# EAGLE design Femtoduino (EAGLE 7.7.0)
REVISION: A; VERSION: 1.0
Assembly variants: Test Variant
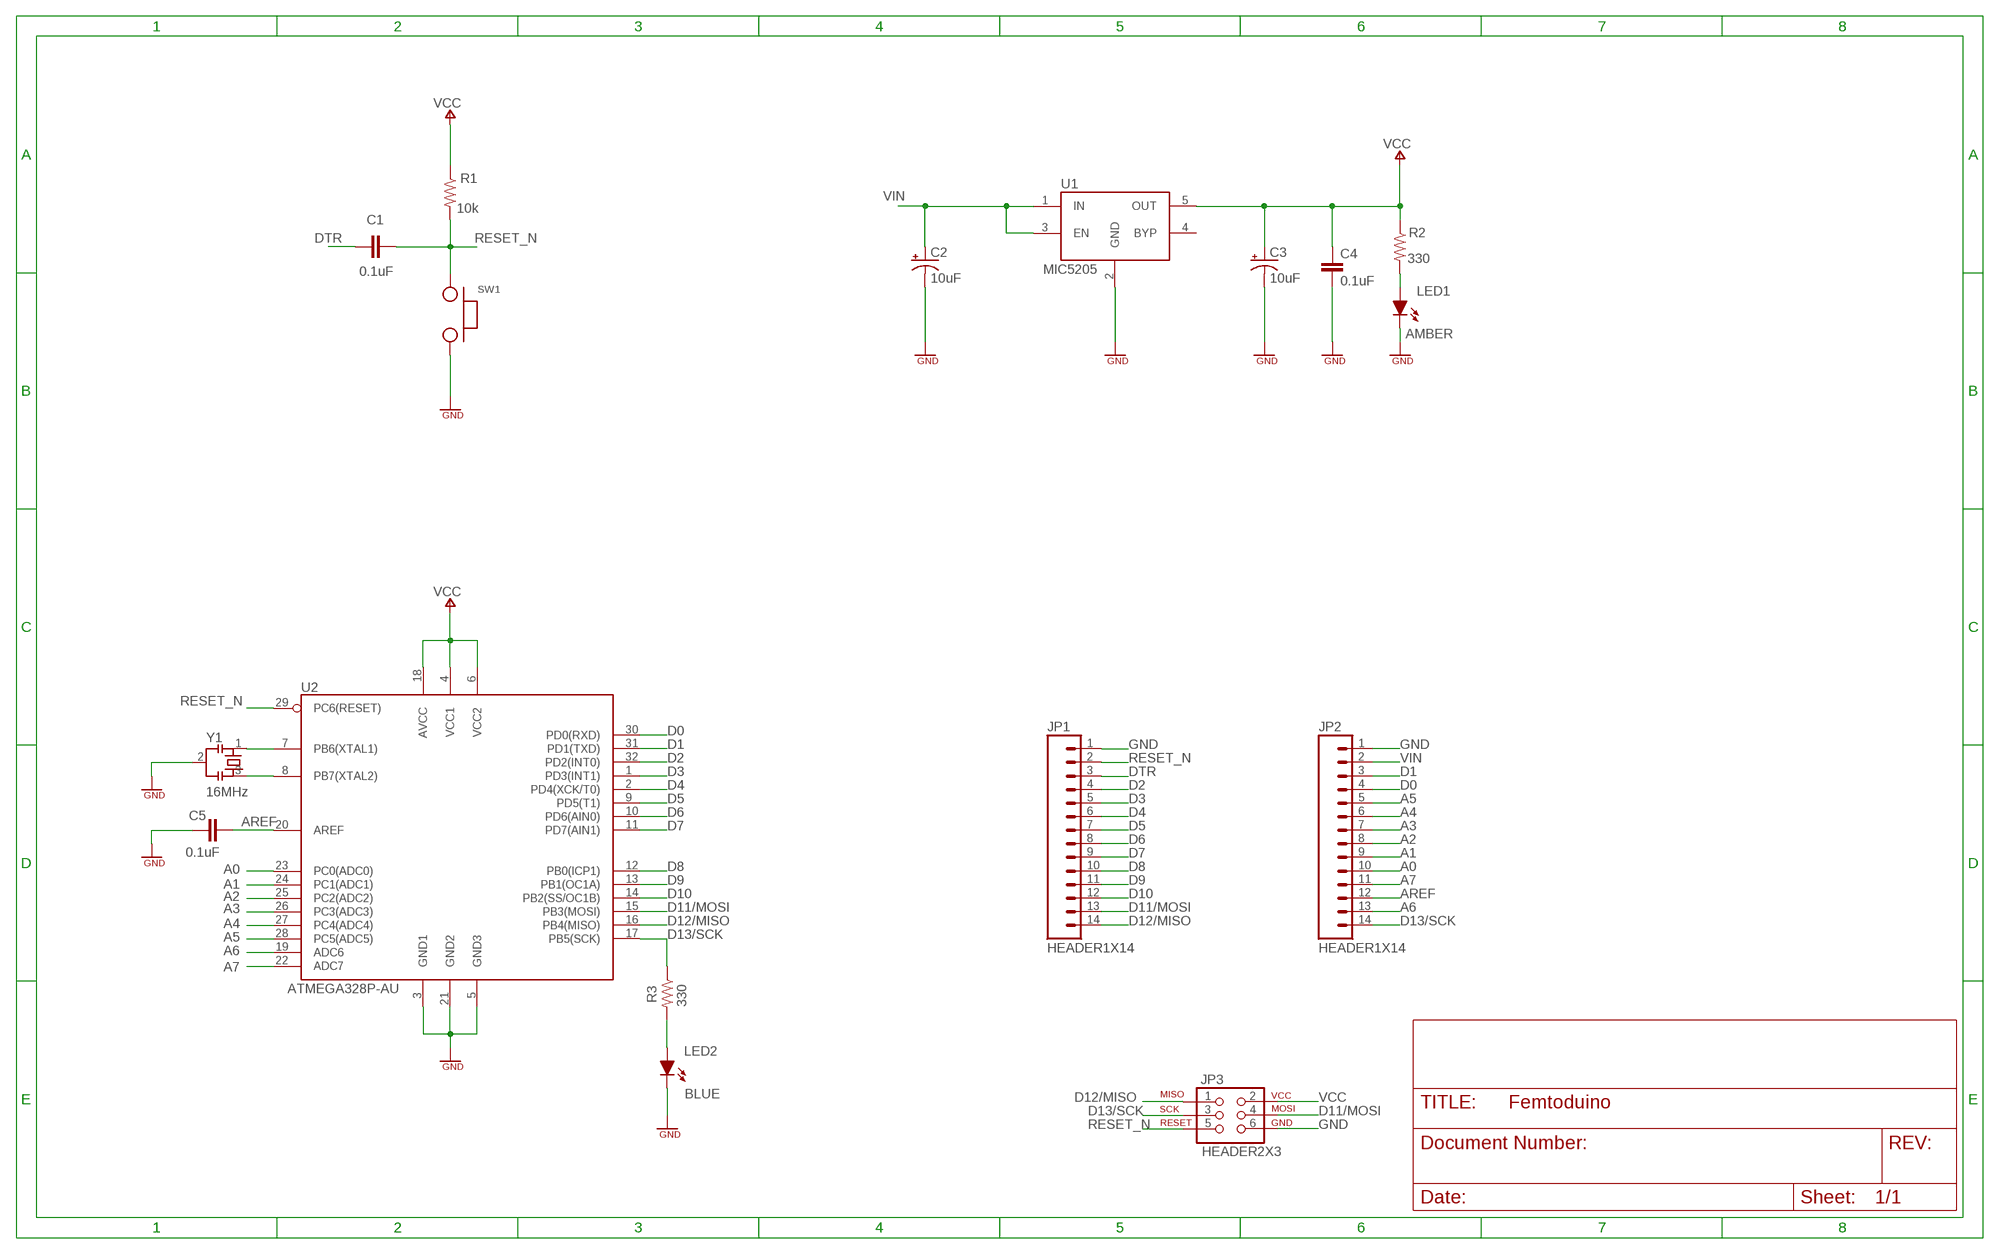
[diagram p0: schematic, sheet 1]

## Parts
C1  0.1uF  CAP_0603  [SMD0603]
C2  10uF  CAP_TANT  [EIA3216]
C3  10uF  CAP_TANT  [EIA3216]
C4  0.1uF  CAP_0603  [SMD0603]
C5  0.1uF  CAP_0603  [SMD0603]
JP1  HEADER1X14  [1X14]
JP2  HEADER1X14  [1X14]
JP3  HEADER2X3  [2X3]
LED1  AMBER  LED_0805  [LED_0805]  (variant Test Variant: GREEN)
LED2  BLUE  LED_0805  [LED_0805]
R1  10k  RES_0603  [SMD0603]
R2  330  RES_0603  [SMD0603]
R3  330  RES_0603  [SMD0603]
SW1  SWITCH  [SWITCH-SPST]
U1  MIC5205  [SOT23-5]
U2  ATMEGA328P-AU  [TQFP32]
Y1  16MHz  CSTCE  [CSTCE]

## Nets
A0: JP2.10 U2.23(PC0(ADC0))
A1: JP2.9 U2.24(PC1(ADC1))
A2: JP2.8 U2.25(PC2(ADC2))
A3: JP2.7 U2.26(PC3(ADC3))
A4: JP2.6 U2.27(PC4(ADC4))
A5: JP2.5 U2.28(PC5(ADC5))
A6: JP2.13 U2.19(ADC6)
A7: JP2.11 U2.22(ADC7)
AREF [AREF]: C5.2 JP2.12 U2.20(AREF)
D0: JP2.4 U2.30(PD0(RXD))
D1: JP2.3 U2.31(PD1(TXD))
D2: JP1.4 U2.32(PD2(INT0))
D3: JP1.5 U2.1(PD3(INT1))
D4: JP1.6 U2.2(PD4(XCK/T0))
D5: JP1.7 U2.9(PD5(T1))
D6: JP1.8 U2.10(PD6(AIN0))
D7: JP1.9 U2.11(PD7(AIN1))
D8: JP1.10 U2.12(PB0(ICP1))
D9: JP1.11 U2.13(PB1(OC1A))
D10: JP1.12 U2.14(PB2(SS/OC1B))
D11/MOSI: JP1.13 JP3.4 U2.15(PB3(MOSI))
D12/MISO: JP1.14 JP3.1 U2.16(PB4(MISO))
D13/SCK: JP2.14 JP3.3 R3.1 U2.17(PB5(SCK))
DTR: C1.1 JP1.3
GND: C2.C(-) C3.C(-) C4.2 C5.1 JP1.1 JP2.1 JP3.6 LED1.C LED2.C SW1.2 U1.2(GND) U2.3(GND1) U2.5(GND3) U2.21(GND2) Y1.2
N$1: LED2.A R3.2
N$2: LED1.A R2.2
N$5: U2.7(PB6(XTAL1)) Y1.1
N$6: U2.8(PB7(XTAL2)) Y1.3
RESET_N: C1.2 JP1.2 JP3.5 R1.2 SW1.1 U2.29(PC6(RESET))
VCC: C3.A(+) C4.1 JP3.2 R1.1 R2.1 U1.5(OUT) U2.4(VCC1) U2.6(VCC2) U2.18(AVCC)
VIN: C2.A(+) JP2.2 U1.1(IN) U1.3(EN)
Unconnected: U1.4(BYP)

## Library data of the parts
C1 C4 C5 = eagle-book:CAP: Non-polarized capacitor
C2 C3 = eagle-book:CAP_TANT: Polarized capacitor (Tantalum)
JP1 JP2 = eagle-book:HEADER1X14: 14-pin header with pins spaced 0.1" apart
JP3 = eagle-book:HEADER2X3: 6-pin header with pins spaced 0.1" apart (HEADD6)
LED1 LED2 = eagle-book:LED: Light Emitting Diode
R1-R3 = eagle-book:RES: Resistor
SW1 = eagle-book:SWITCH: Two-input single pole, single throw (SPST) switch
U1 = eagle-book:MIC5205: 5-volt voltage regulator (UA78M05)
U2 = eagle-book:ATMEGA328P: Atmel 32-pin 8-bit microcontroller
Y1 = eagle-book:CSTCE: SMD resonator from Murata (CSTCE16M0V53-S0)

## Net classes
0 default: width 0.203 mm
1 VCC: width 0.305 mm, drill 0.406 mm
2 VIN: width 0.305 mm, drill 0.406 mm
3 AREF: width 0.254 mm, drill 0.406 mm
4 GND: width 0.254 mm, drill 0.406 mm

## Board
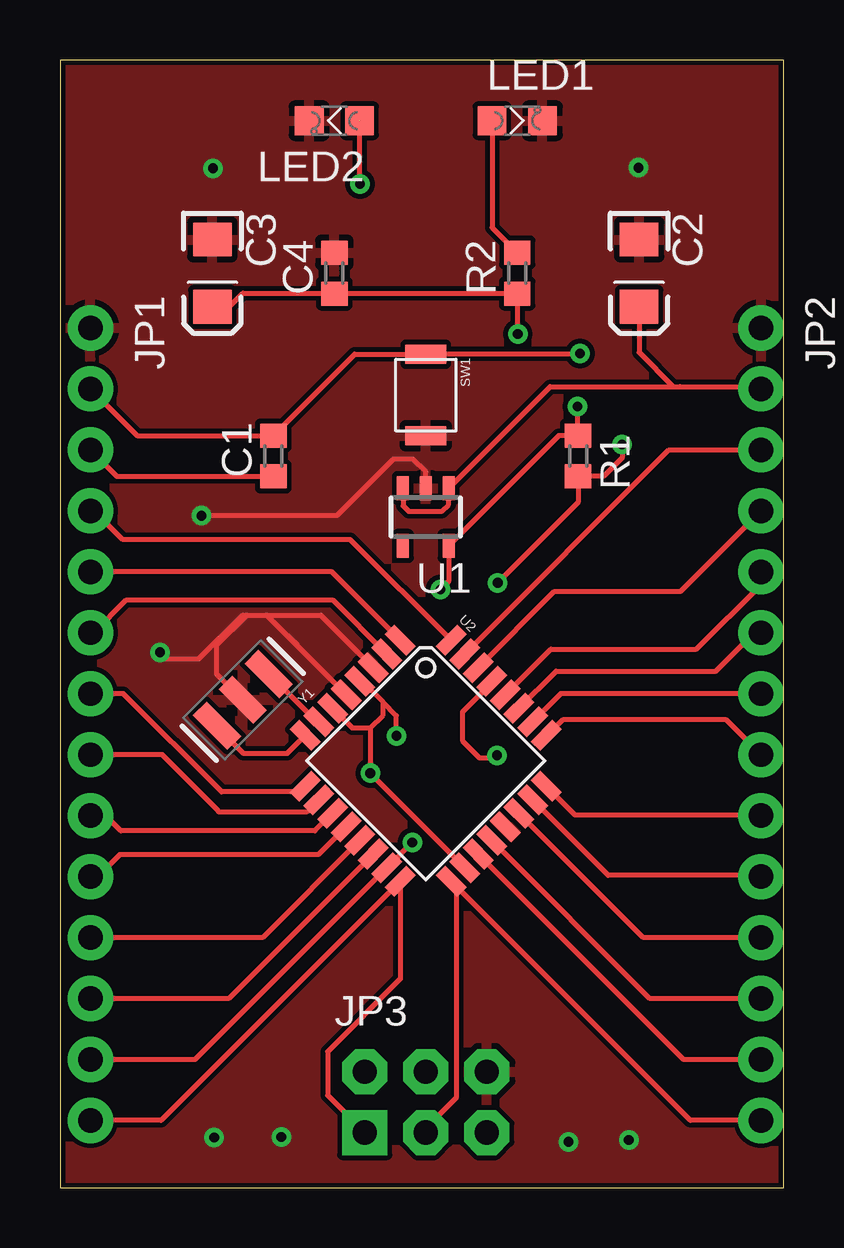
[diagram p1: board, top side]
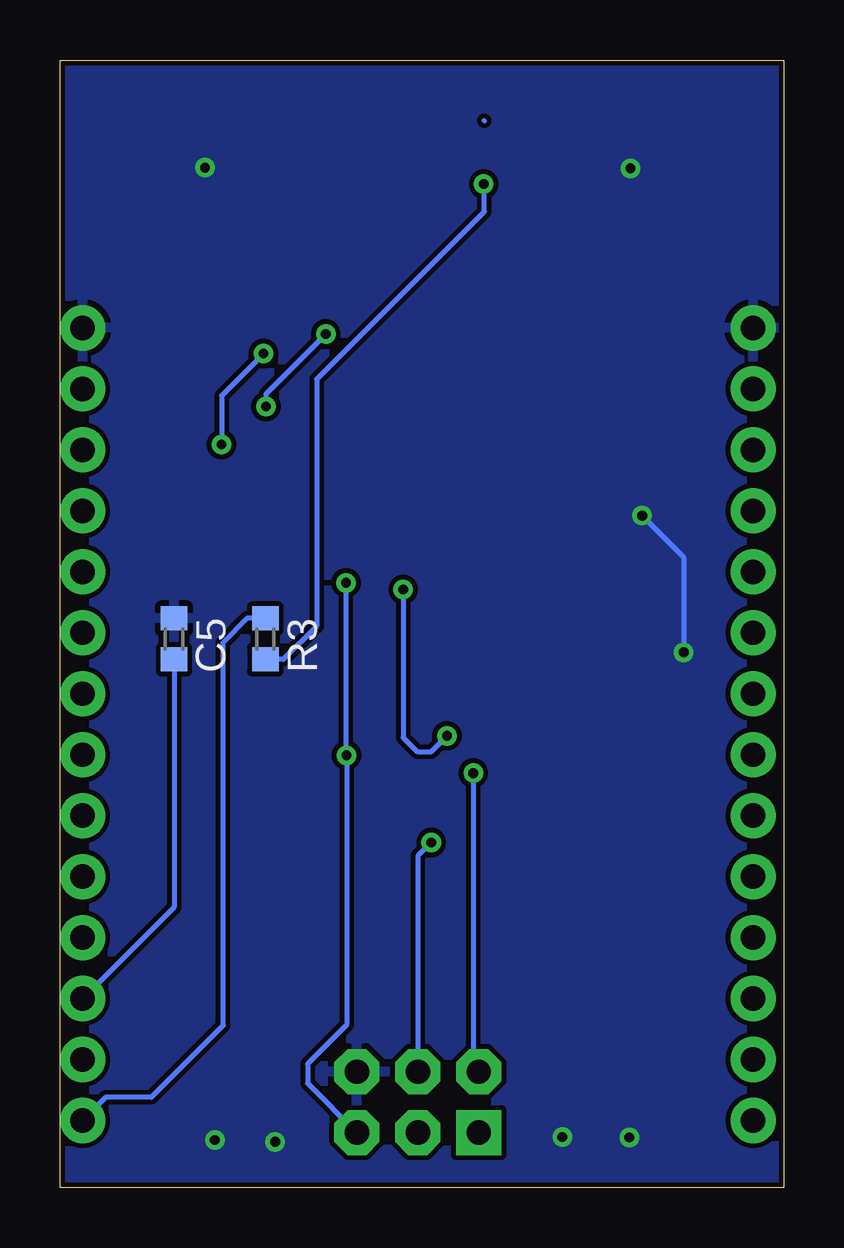
[diagram p2: board, bottom side, seen from below]

Size 30.15 x 46.98 mm. Coordinates in mm from the lower left corner, seen from the top.
Outline: 0,0 30.15,0 30.15,46.98 0,46.98 0,0
Copper layers (1*16): Top 0.035mm / dielectric 1.5mm / Bottom 0.035mm
Design rules "femtoduino": minimum track width 8mil, minimum drill 16mil, track to track 8mil, track to pad 8mil, pad to pad 8mil, via to via 8mil, smd to smd 8mil, copper to edge 8mil, drill to drill 8mil, minimum pad ring 10mil, minimum via ring 8mil, stop-mask expansion 4mil, vias tented up to drill 0mil, thermal gap 10mil

### Footprints (pad centres in the part's own frame; a part is rotated, then mirrored left to right if it is on the bottom)
SMD0603 = smd 1 x 1.1: 1 -0.85,0; 2 0.85,0
EIA3216 = smd 1.4 x 1.6: A 1.4,0; C -1.4,0
1X14 = drill 1.016 pad 1.88: 1 0,0; 2 2.54,0; 3 5.08,0; 4 7.62,0; 5 10.16,0; 6 12.7,0; 7 15.24,0; 8 17.78,0; 9 20.32,0; 10 22.86,0; 11 25.4,0; 12 27.94,0; 13 30.48,0; 14 33.02,0
2X3 = drill 1.016 pad 1.88 square: 1 -2.54,-1.27 | drill 1.016 pad 1.88 octagon: 2 -2.54,1.27; 3 0,-1.27; 4 0,1.27; 5 2.54,-1.27; 6 2.54,1.27
LED_0805 = smd 1.2 x 1.2: A 0,-1.05; C 0,1.05
SWITCH-SPST = smd 0.8 x 1.7: 1 -1.7,0; 2 1.7,0
SOT23-5 = smd 0.5 x 1: 1 -0.95,-1.2; 2 0,-1.2; 3 0.95,-1.2; 4 0.95,1.2; 5 -0.95,1.2
TQFP32 = smd 1.27 x 0.559: 1 -4.293,2.8; 2 -4.293,2; 3 -4.293,1.2; 4 -4.293,0.4; 5 -4.293,-0.4; 6 -4.293,-1.2; 7 -4.293,-2; 8 -4.293,-2.8; 17 4.293,-2.8; 18 4.293,-2; 19 4.293,-1.2; 20 4.293,-0.4; 21 4.293,0.4; 22 4.293,1.2; 23 4.293,2; 24 4.293,2.8 | smd 0.559 x 1.27: 9 -2.8,-4.293; 10 -2,-4.293; 11 -1.2,-4.293; 12 -0.4,-4.293; 13 0.4,-4.293; 14 1.2,-4.293; 15 2,-4.293; 16 2.8,-4.293; 25 2.8,4.293; 26 2,4.293; 27 1.2,4.293; 28 0.4,4.293; 29 -0.4,4.293; 30 -1.2,4.293; 31 -2,4.293; 32 -2.8,4.293
CSTCE = smd 0.8 x 2.032: 1 -1.524,0; 2 0,0; 3 1.524,0

### Placement (x,y rotation side)
C1  8.89,30.48 90 top
C2  24.13,38.1 270 top
C3  6.35,38.1 270 top
C4  11.43,38.1 90 top
C5  25.4,22.86 270 bottom
JP1  1.27,35.81 270 top
JP2  29.21,35.81 270 top
JP3  15.24,3.56 0 top
LED1  19.05,44.45 270 top
LED2  11.43,44.45 90 top
R1  21.59,30.48 270 top
R2  19.05,38.1 90 top
R3  21.59,22.86 270 bottom
SW1  15.24,33.02 270 top
U1  15.24,27.94 180 top
U2  15.24,17.78 315 top
Y1  7.62,20.32 225 top

### Tracks (layer width: path | path; a pad name or v marks a point on that pad's centre or on a via)
A0
  Top 0.203: JP2.10 29.11,12.95 29.06,13.01 22.84,13.01 U2.23
A1
  Top 0.203: JP2.9 29.39,15.49 29.41,15.52 21.46,15.52 U2.24
A2
  Top 0.203: JP2.8 27.76,19.48 20.95,19.48 20.31,18.84 U2.25
A3
  Top 0.203: JP2.7 20.86,20.57 U2.26
A4
  Top 0.203: U2.27 20.67,21.51 27.33,21.51 28.93,23.11 JP2.6
A5
  Top 0.203: U2.28 20.45,22.43 26.52,22.43 29.21,25.12 JP2.5
A6
  Top 0.203: JP2.13 25.99,5.33 U2.19
A7
  Top 0.203: JP2.11 24.3,10.41 U2.22
AREF
  Top 0.203: JP2.12 24.58,7.87 U2.20
  Bottom 0.203: C5.2 25.4,11.68 JP2.12
D0
  Top 0.203: U2.30 20.6,24.84 25.86,24.84 JP2.4
D1
  Top 0.203: U2.31 25.37,30.73 JP2.3
D2
  Top 0.203: U2.32 12.09,27 2.62,27 1.42,28.19 JP1.4
D3
  Top 0.203: U2.1 11.33,25.65 JP1.5
D4
  Top 0.203: U2.2 11.39,24.46 2.74,24.46 1.4,23.11 JP1.6
D5
  Top 0.203: U2.9 9.98,16.48 6.73,16.48 2.64,20.57 JP1.7
D6
  Top 0.203: U2.10 10.28,15.65 6.63,15.65 6.6,15.67 6.6,15.7 4.27,18.03 JP1.8
D7
  Top 0.203: U2.11 10.62,14.86 2.54,14.86 1.91,15.49 JP1.9
D8
  Top 0.203: U2.12 10.76,13.87 2.49,13.87 1.57,12.95 JP1.10
D9
  Top 0.203: U2.13 8.44,10.41 JP1.11
D10
  Top 0.203: U2.14 7.03,7.87 JP1.12
D11/MOSI  (via drill 0.41)
  Top 0.203: JP1.13 5.62,5.33 U2.15 13.63,13.33 v14.68,14.38
  Bottom 0.203: v14.68,14.38 15.24,13.82 JP3.4
D12/MISO
  Top 0.203: JP1.14 4.21,2.79 U2.16 14.19,8.7 11.15,5.66 11.15,3.83 JP3.1
D13/SCK
  Top 0.203: JP2.14 26.27,2.79 U2.17 16.51,12.55 16.51,3.73 15.24,2.46 JP3.3
  Bottom 0.203: JP2.14 28.25,3.76 26.34,3.76 23.34,6.76 23.37,6.78 23.37,22.71 22.37,23.71 R3.1
DTR
  Top 0.203: JP1.3 2.37,29.63 C1.1
GND  (via drill 0.41)
  Top 0.203: Y1.2 7.59,20.32 6.53,21.39 6.53,22.61 7.77,23.85 | 7.77,23.85 8.61,23.85 | 8.61,23.85 10.87,23.85 U2.3 | U2.5 9.92,22.54 | 9.92,22.54 8.61,23.85 | 9.92,22.54 9.92,22.57 9.5,22.99 | U1.2 15.24,29.82 14.71,30.35 13.89,30.35 11.53,27.99 v5.89,27.99 | 7.77,23.85 7.62,23.85 5.79,22.02 4.45,22.02 v4.17,22.3
  Bottom 0.203: v5.89,27.99 4.17,26.26 v4.17,22.3
  other vias: 6.38,42.47 24.1,42.49 6.43,2.08 9.22,2.11 21.18,1.91 23.7,1.98
  pour Top: 0.25,46.74 0.25,0.25 29.97,0.25 29.97,46.74
  pour Bottom: 0.25,46.74 29.97,46.74 29.97,0.25 0.25,0.25
N$1  (via drill 0.41)  (1 unrouted)
  Top 0.203: v12.5,41.81 LED2.A
  Bottom 0.203: LED2.A | v12.5,41.81 12.47,41.78 12.47,40.66 19.46,33.68 19.46,23.39 20.84,22.01 R3.2
N$2
  Top 0.203: LED1.A 18,40 R2.2
N$5
  Top 0.203: U2.7 10.69,19.4 Y1.1
N$6
  Top 0.203: Y1.3 6.54,19.19 7.64,18.09 9.47,18.09 U2.8
RESET_N  (via drill 0.41)
  Top 0.203: JP1.2 3.21,31.33 C1.2 12.28,34.72 SW1.1 15.27,34.75 v21.67,34.75 | v18.24,25.2 21.59,28.55 R1.2 22.66,29.64 23.42,30.4 v23.42,30.96 | U2.29 17.99,21.04 16.76,19.81 16.76,18.62 17.48,17.91 18.11,17.91 v18.21,18.01
  Bottom 0.203: v18.24,25.2 18.24,18.03 v18.21,18.01 18.21,6.78 19.84,5.16 19.84,4.34 JP3.5 | v21.67,34.75 23.42,32.99 v23.42,30.96
VCC  (via drill 0.41)
  Top 0.203: U2.6 12.17,19.15 12.93,19.15 | 12.93,19.15 13.46,19.68 13.46,20.22 | 13.46,20.22 12.58,21.1 U2.4 | 12.93,19.15 v12.93,17.27 v12.93,17.26 U2.18 | C3.A 7.06,36.7 7.62,37.26 11.43,37.26 C4.1 11.51,37.26 19.05,37.26 R2.1 19.07,37.23 v19.07,35.56 | v21.57,32.54 21.57,31.36 R1.1 20.78,31.33 U1.5 16.19,25.26 v15.85,24.92 | v14.02,18.82 14.02,19.66 13.46,20.22
  Bottom 0.203: v12.93,17.26 12.93,5.05 JP3.2 | v21.57,32.54 21.57,33.07 v19.07,35.56 19.05,35.53 19.05,35.51 | v15.85,24.92 15.85,18.75 15.27,18.16 14.68,18.16 v14.02,18.82
VIN
  Top 0.203: C2.A 24.13,34.8 25.55,33.38 | 25.55,33.38 25.83,33.38 29.11,33.38 JP2.2 | U1.3 14.3,28.4 14.53,28.17 15.9,28.17 16.19,28.46 U1.1 20.43,33.38 25.55,33.38